# EAGLE design B167X (EAGLE 6.6.0)
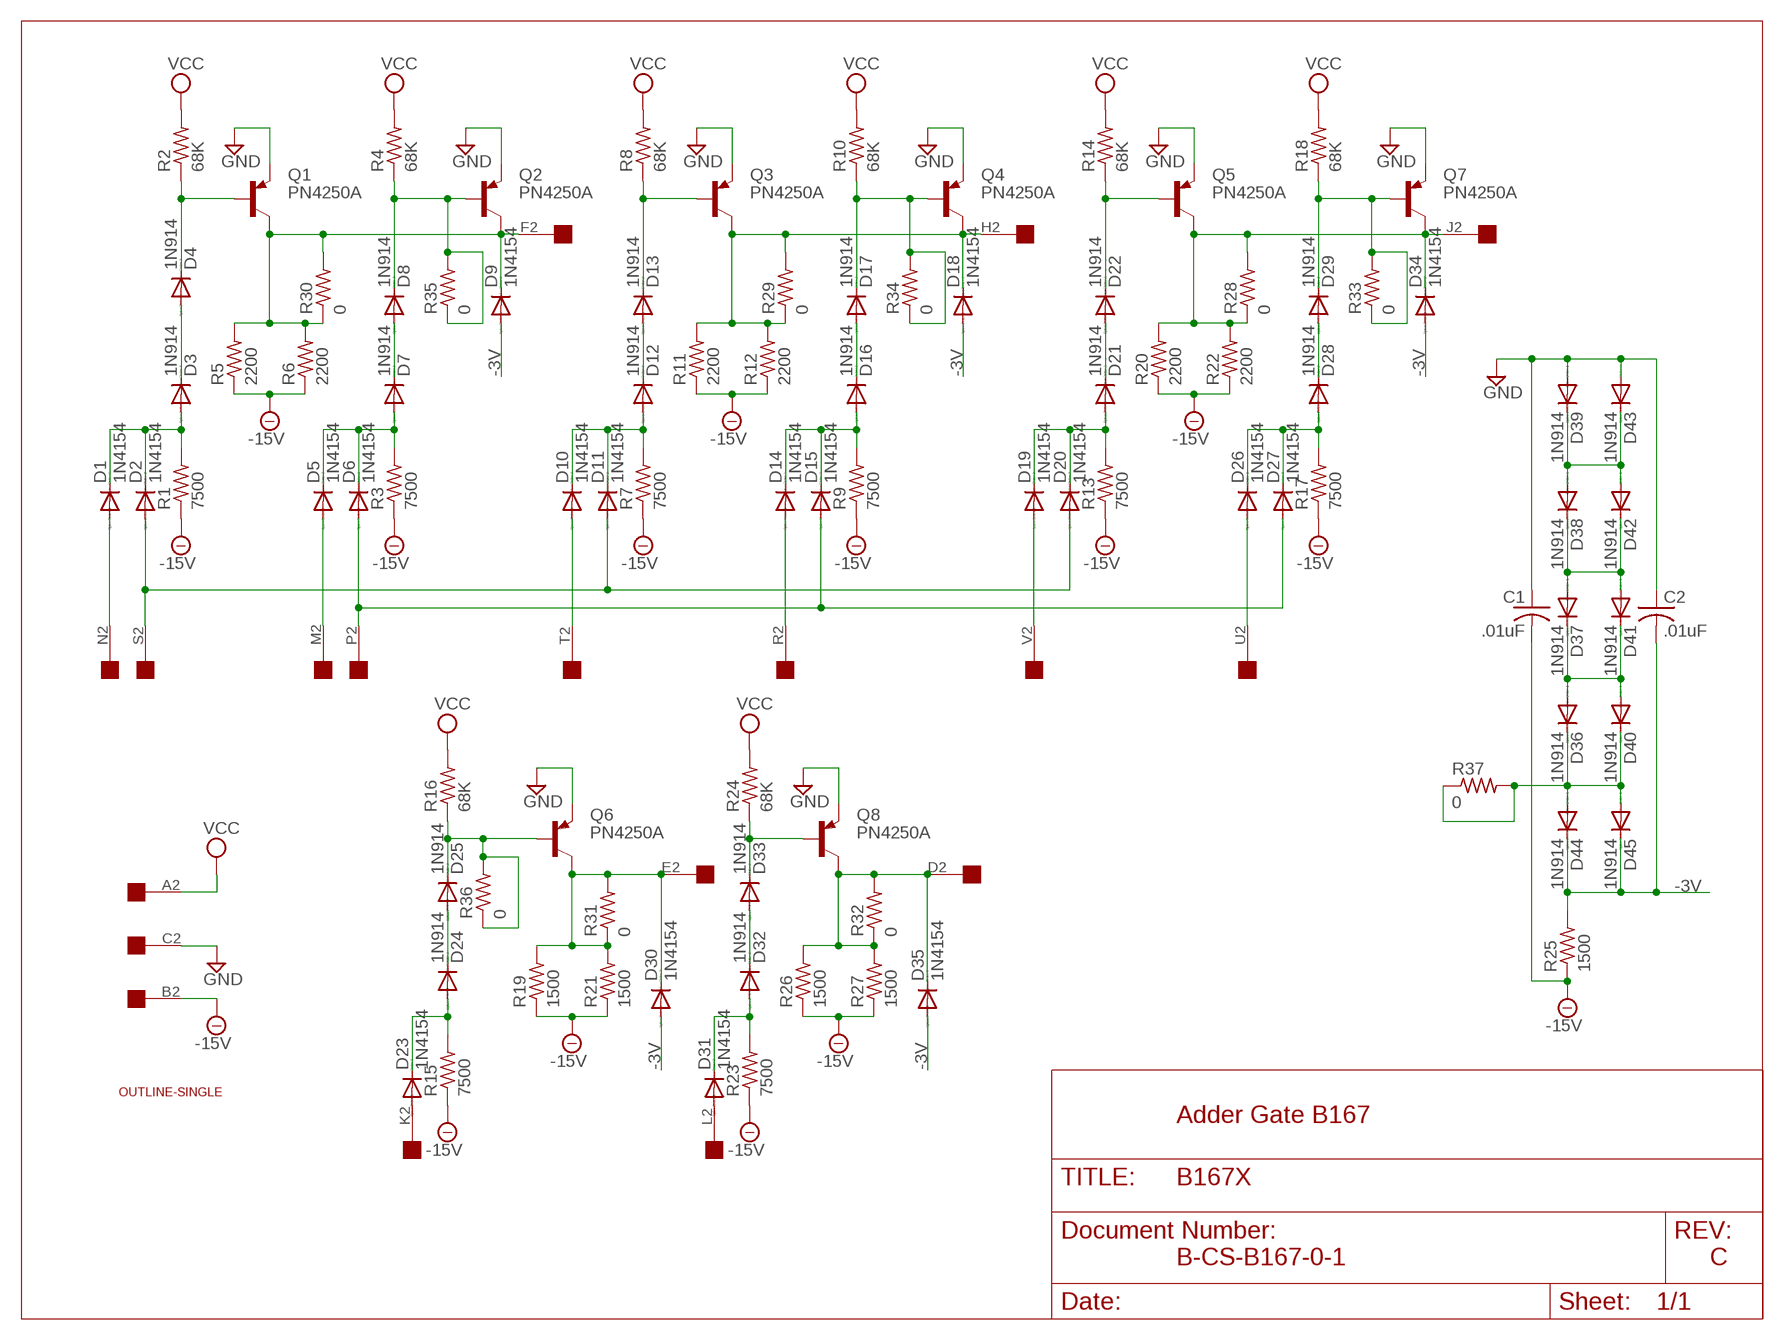
[diagram p0: schematic, sheet 1]

## Parts
C1  .01uF  C-US  [C063-025X075]
C2  .01uF  C-US  [C063-025X075]
D1  1N4154  DIODE-DO35-10  [DO35-10]
D2  1N4154  DIODE-DO35-10  [DO35-10]
D3  1N914  DIODE-DO35-10  [DO35-10]
D4  1N914  DIODE-DO35-10  [DO35-10]
D5  1N4154  DIODE-DO35-10  [DO35-10]
D6  1N4154  DIODE-DO35-10  [DO35-10]
D7  1N914  DIODE-DO35-10  [DO35-10]
D8  1N914  DIODE-DO35-10  [DO35-10]
D9  1N4154  DIODE-DO35-10  [DO35-10]
D10  1N4154  DIODE-DO35-10  [DO35-10]
D11  1N4154  DIODE-DO35-10  [DO35-10]
D12  1N914  DIODE-DO35-10  [DO35-10]
D13  1N914  DIODE-DO35-10  [DO35-10]
D14  1N4154  DIODE-DO35-10  [DO35-10]
D15  1N4154  DIODE-DO35-10  [DO35-10]
D16  1N914  DIODE-DO35-10  [DO35-10]
D17  1N914  DIODE-DO35-10  [DO35-10]
D18  1N4154  DIODE-DO35-10  [DO35-10]
D19  1N4154  DIODE-DO35-10  [DO35-10]
D20  1N4154  DIODE-DO35-10  [DO35-10]
D21  1N914  DIODE-DO35-10  [DO35-10]
D22  1N914  DIODE-DO35-10  [DO35-10]
D23  1N4154  DIODE-DO35-10  [DO35-10]
D24  1N914  DIODE-DO35-10  [DO35-10]
D25  1N914  DIODE-DO35-10  [DO35-10]
D26  1N4154  DIODE-DO35-10  [DO35-10]
D27  1N4154  DIODE-DO35-10  [DO35-10]
D28  1N914  DIODE-DO35-10  [DO35-10]
D29  1N914  DIODE-DO35-10  [DO35-10]
D30  1N4154  DIODE-DO35-10  [DO35-10]
D31  1N4154  DIODE-DO35-10  [DO35-10]
D32  1N914  DIODE-DO35-10  [DO35-10]
D33  1N914  DIODE-DO35-10  [DO35-10]
D34  1N4154  DIODE-DO35-10  [DO35-10]
D35  1N4154  DIODE-DO35-10  [DO35-10]
D36  1N914  DIODE-DO35-10  [DO35-10]
D37  1N914  DIODE-DO35-10  [DO35-10]
D38  1N914  DIODE-DO35-10  [DO35-10]
D39  1N914  DIODE-DO35-10  [DO35-10]
D40  1N914  DIODE-DO35-10  [DO35-10]
D41  1N914  DIODE-DO35-10  [DO35-10]
D42  1N914  DIODE-DO35-10  [DO35-10]
D43  1N914  DIODE-DO35-10  [DO35-10]
D44  1N914  DIODE-DO35-10  [DO35-10]
D45  1N914  DIODE-DO35-10  [DO35-10]
Q1  PN4250A  -PNP-TO5  [TO5]
Q2  PN4250A  -PNP-TO5  [TO5]
Q3  PN4250A  -PNP-TO5  [TO5]
Q4  PN4250A  -PNP-TO5  [TO5]
Q5  PN4250A  -PNP-TO5  [TO5]
Q6  PN4250A  -PNP-TO5  [TO5]
Q7  PN4250A  -PNP-TO5  [TO5]
Q8  PN4250A  -PNP-TO5  [TO5]
R1  7500  R-US_0207/10  [0207/10]
R2  68K  R-US_0207/10  [0207/10]
R3  7500  R-US_0207/10  [0207/10]
R4  68K  R-US_0207/10  [0207/10]
R5  2200  R-US_0207/10  [0207/10]
R6  2200  R-US_0207/10  [0207/10]
R7  7500  R-US_0207/10  [0207/10]
R8  68K  R-US_0207/10  [0207/10]
R9  7500  R-US_0207/10  [0207/10]
R10  68K  R-US_0207/10  [0207/10]
R11  2200  R-US_0207/10  [0207/10]
R12  2200  R-US_0207/10  [0207/10]
R13  7500  R-US_0207/10  [0207/10]
R14  68K  R-US_0207/10  [0207/10]
R15  7500  R-US_0207/10  [0207/10]
R16  68K  R-US_0207/10  [0207/10]
R17  7500  R-US_0207/10  [0207/10]
R18  68K  R-US_0207/10  [0207/10]
R19  1500  R-US_0207/10  [0207/10]
R20  2200  R-US_0207/10  [0207/10]
R21  1500  R-US_0207/10  [0207/10]
R22  2200  R-US_0207/10  [0207/10]
R23  7500  R-US_0207/10  [0207/10]
R24  68K  R-US_0207/10  [0207/10]
R25  1500  R-US_0207/10  [0207/10]
R26  1500  R-US_0207/10  [0207/10]
R27  1500  R-US_0207/10  [0207/10]
R28  0  R-US_0207/10  [0207/10]
R29  0  R-US_0207/10  [0207/10]
R30  0  R-US_0207/10  [0207/10]
R31  0  R-US_0207/10  [0207/10]
R32  0  R-US_0207/10  [0207/10]
R33  0  R-US_0207/10  [0207/10]
R34  0  R-US_0207/10  [0207/10]
R35  0  R-US_0207/10  [0207/10]
R36  0  R-US_0207/10  [0207/10]
R37  0  R-US_0207/10  [0207/10]
U$1  OUTLINE-SINGLE  [SINGLE]
U$2  EDGE-1  [EDGE-CON1]

## Nets
-3V: C2.2 D9.A D18.A D30.A D34.A D35.A D44.C D45.C R25.2
-15V: C1.2 R1.1 R3.1 R5.1 R6.1 R7.1 R9.1 R11.1 R12.1 R13.1 R15.1 R17.1 R19.1 R20.1 R21.1 R22.1 R23.1 R25.1 R26.1 R27.1 U$2.B2
GND: C1.1 C2.1 D39.A D43.A Q1.1(E) Q2.1(E) Q3.1(E) Q4.1(E) Q5.1(E) Q6.1(E) Q7.1(E) Q8.1(E) U$2.C2
N$1: D4.C Q1.2(B) R2.1
N$2: D3.C D4.A
N$3: D1.C D2.C D3.A R1.2
N$4: D8.C Q2.2(B) R4.1 R35.1 R35.2
N$5: D7.C D8.A
N$6: D5.C D6.C D7.A R3.2
N$7: D9.C Q1.3(C) Q2.3(C) R5.2 R6.2 R30.1 R30.2 U$2.F2
N$8: D13.C Q3.2(B) R8.1
N$9: D12.C D13.A
N$10: D10.C D11.C D12.A R7.2
N$11: D17.C Q4.2(B) R10.1 R34.1 R34.2
N$12: D16.C D17.A
N$13: D14.C D15.C D16.A R9.2
N$14: D18.C Q3.3(C) Q4.3(C) R11.2 R12.2 R29.1 R29.2 U$2.H2
N$15: D22.C Q5.2(B) R14.1
N$16: D21.C D22.A
N$17: D19.C D20.C D21.A R13.2
N$18: D29.C Q7.2(B) R18.1 R33.1 R33.2
N$19: D28.C D29.A
N$20: D26.C D27.C D28.A R17.2
N$21: D34.C Q5.3(C) Q7.3(C) R20.2 R22.2 R28.1 R28.2 U$2.J2
N$22: D25.C Q6.2(B) R16.1 R36.1 R36.2
N$23: D24.C D25.A
N$24: D23.C D24.A R15.2
N$25: D30.C Q6.3(C) R19.2 R21.2 R31.1 R31.2 U$2.E2
N$26: D33.C Q8.2(B) R24.1
N$27: D32.C D33.A
N$28: D31.C D32.A R23.2
N$29: D35.C Q8.3(C) R26.2 R27.2 R32.1 R32.2 U$2.D2
N$30: D38.A D39.C D42.A D43.C
N$31: D23.A U$2.K2
N$32: D37.A D38.C D41.A D42.C
N$33: D31.A U$2.L2
N$34: D36.A D37.C D40.A D41.C
N$35: D1.A U$2.N2
N$36: D2.A D11.A D20.A U$2.S2
N$37: D36.C D40.C D44.A D45.A R37.1 R37.2
N$38: D5.A U$2.M2
N$39: D6.A D15.A D27.A U$2.P2
N$40: D10.A U$2.T2
N$41: D14.A U$2.R2
N$42: D19.A U$2.V2
N$43: D26.A U$2.U2
VCC: R2.2 R4.2 R8.2 R10.2 R14.2 R16.2 R18.2 R24.2 U$2.A2

## Notes on the sheet
- Adder Gate B167
- B-CS-B167-0-1 | C

## Library data of the parts
C1 C2 = dec-con:C-US: Capacitors with funky DEC lead spacing.
D1-D45 = diode:DIODE-: DIODE
Q1-Q8 = transistor:*-PNP-: PNP Transistror
R1-R37 = rcl:R-US_: RESISTOR, American symbol
U$1 = dec-con:OUTLINE-*: Board outlines for DEC boards.
U$2 = dec-con:EDGE-1: Single-Sided DEC Edge Connector -- (side 2)

## Board
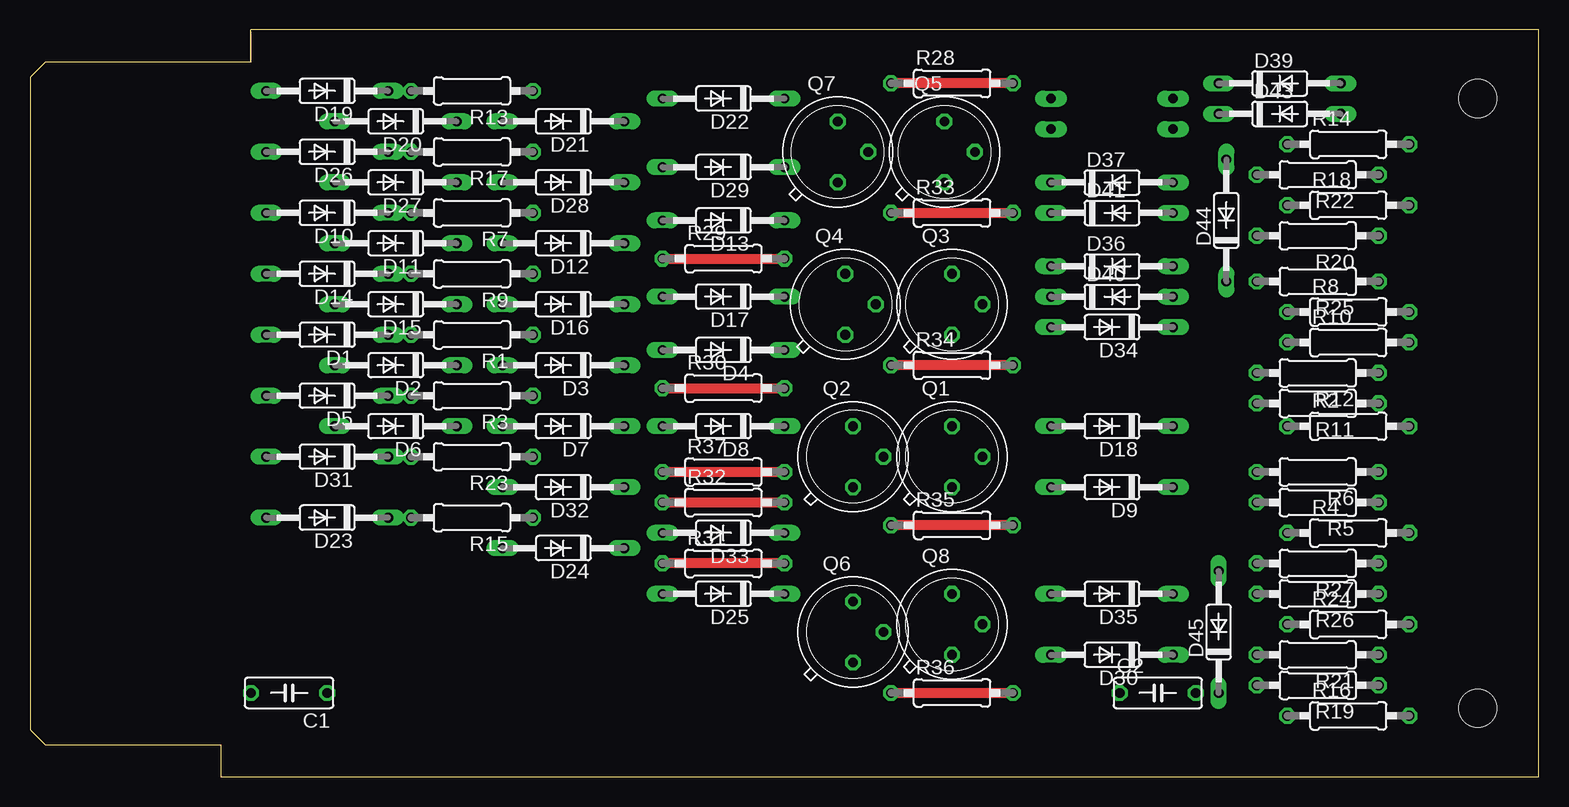
[diagram p1: board, top side]
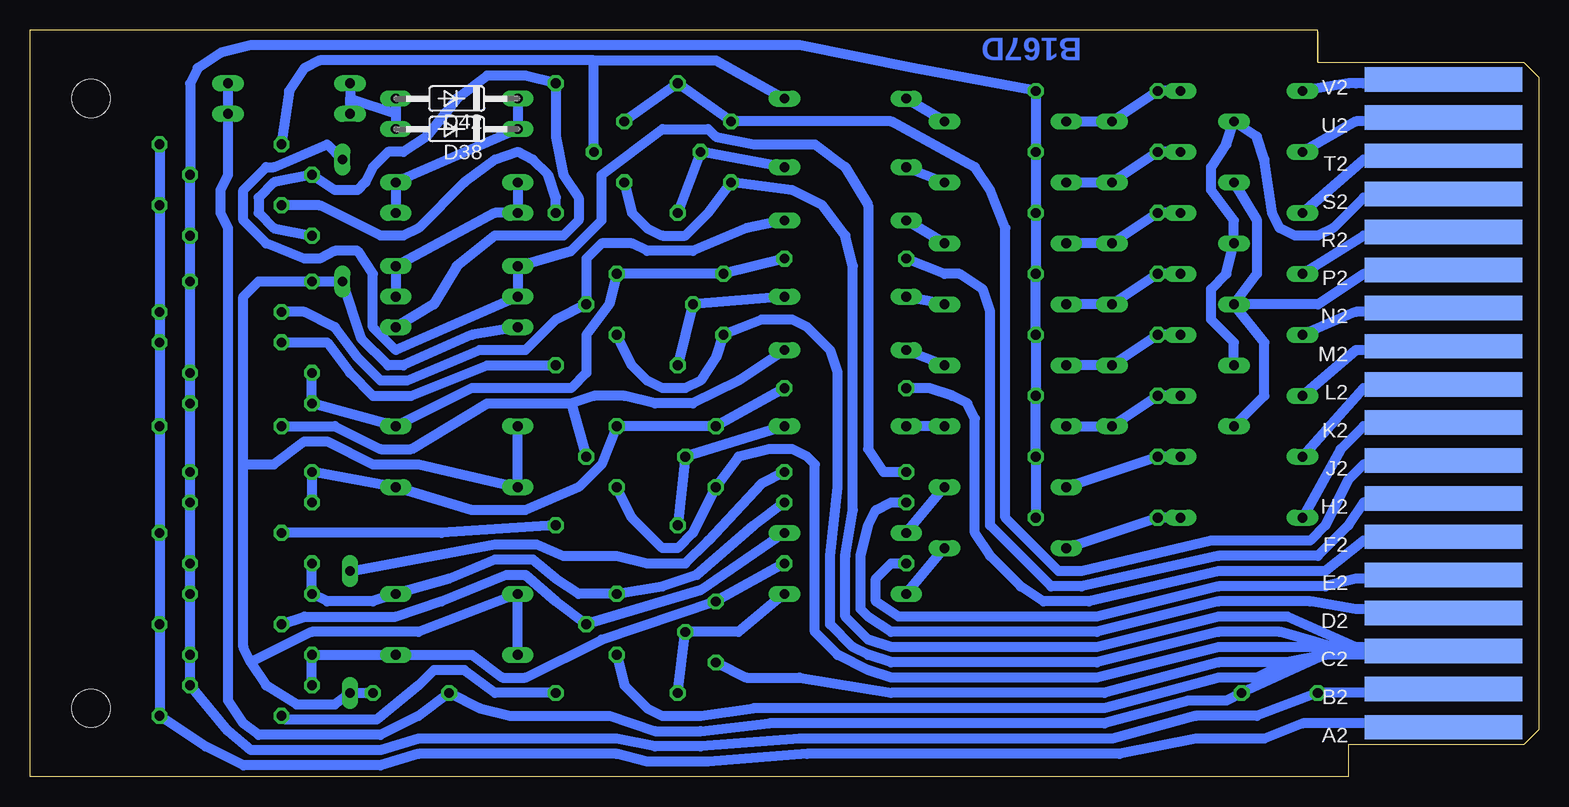
[diagram p2: board, bottom side, seen from below]

Size 125.73 x 62.23 mm. Coordinates in mm from the lower left corner, seen from the top.
Copper layers (1+16): Top 0.035mm / dielectric 1.5mm / Bottom 0.035mm
Design rules "16mils": minimum track width 16mil, minimum drill 32mil, track to track 15mil, track to pad 10mil, pad to pad 10mil, via to via 10mil, smd to smd 10mil, copper to edge 13mil, drill to drill 10mil, minimum pad ring 10mil, minimum via ring 8mil, stop-mask expansion 0mil, vias tented up to drill 0mil, thermal gap 10mil

### Footprints (pad centres in the part's own frame; a part is rotated, then mirrored left to right if it is on the bottom)
C063-025X075 = drill 0.813 octagon: 1 -2.54,0; 2 3.81,0
DO35-10 = drill 0.813 long: A 5.08,0; C -5.08,0
TO5 = drill 0.813 octagon: 1 0,-2.54; 2 2.54,0; 3 0,2.54
0207/10 = drill 0.813 octagon: 1 -5.08,0; 2 5.08,0
SINGLE = hole 3.175: 120.65,56.515; 120.65,5.715
EDGE-CON1 = smd 13.106 x 2.032 bottom: A2 7.938,4.128; B2 7.938,7.303; C2 7.938,10.477; D2 7.938,13.652; E2 7.938,16.828; F2 7.938,20.003; H2 7.938,23.177; J2 7.938,26.352; K2 7.938,29.527; L2 7.938,32.703; M2 7.938,35.877; N2 7.938,39.053; P2 7.938,42.227; R2 7.938,45.403; S2 7.938,48.578; T2 7.938,51.752; U2 7.938,54.928; V2 7.938,58.102

### Placement (x,y rotation side)
C1  22.23,6.99 180 top
C2  93.35,6.99 0 top
D1  24.77,36.83 180 top
D2  30.48,34.29 180 top
D3  44.45,34.29 180 top
D4  57.79,35.56 180 top
D5  24.77,31.75 180 top
D6  30.48,29.21 180 top
D7  44.45,29.21 180 top
D8  57.79,29.21 180 top
D9  90.17,24.13 180 top
D10  24.77,46.99 180 top
D11  30.48,44.45 180 top
D12  44.45,44.45 180 top
D13  57.79,46.35 180 top
D14  24.77,41.91 180 top
D15  30.48,39.37 180 top
D16  44.45,39.37 180 top
D17  57.79,40.01 180 top
D18  90.17,29.21 180 top
D19  24.77,57.15 180 top
D20  30.48,54.61 180 top
D21  44.45,54.61 180 top
D22  57.79,56.52 180 top
D23  24.77,21.59 180 top
D24  44.45,19.05 180 top
D25  57.79,15.24 180 top
D26  24.77,52.07 180 top
D27  30.48,49.53 180 top
D28  44.45,49.53 180 top
D29  57.79,50.8 180 top
D30  90.17,10.16 180 top
D31  24.77,26.67 180 top
D32  44.45,24.13 180 top
D33  57.79,20.32 180 top
D34  90.17,37.47 180 top
D35  90.17,15.24 180 top
D36  90.17,42.55 0 top
D37  90.17,49.53 0 top
D38  90.17,53.98 180 bottom
D39  104.14,57.78 0 top
D40  90.17,40.01 0 top
D41  90.17,46.99 0 top
D42  90.17,56.52 180 bottom
D43  104.14,55.24 0 top
D44  99.7,46.35 90 top
D45  99.06,12.06 90 top
Q1  76.84,26.67 0 top
Q2  68.58,26.67 0 top
Q3  76.84,39.37 0 top
Q4  67.95,39.37 0 top
Q5  76.2,52.07 0 top
Q6  68.58,12.06 0 top
Q7  67.31,52.07 0 top
Q8  76.84,12.7 0 top
R1  36.83,36.83 180 top
R2  109.86,29.21 0 top
R3  36.83,31.75 180 top
R4  109.86,20.32 0 top
R5  107.32,22.86 180 top
R6  107.32,25.4 180 top
R7  36.83,46.99 180 top
R8  109.86,38.73 0 top
R9  36.83,41.91 180 top
R10  109.86,36.2 0 top
R11  107.32,31.11 180 top
R12  107.32,33.66 180 top
R13  36.83,57.15 180 top
R14  109.86,52.7 0 top
R15  36.83,21.59 180 top
R16  109.86,5.08 0 top
R17  36.83,52.07 180 top
R18  109.86,47.62 0 top
R19  107.32,7.62 180 top
R20  107.32,45.09 180 top
R21  107.32,10.16 180 top
R22  107.32,50.16 180 top
R23  36.83,26.67 180 top
R24  109.86,12.7 0 top
R25  107.32,41.27 180 top
R26  107.32,15.24 180 top
R27  107.32,17.78 180 top
R28  76.84,57.78 0 top
R29  57.79,43.18 0 top
R30  57.79,32.38 0 top
R31  57.79,17.78 0 top
R32  57.79,22.86 0 top
R33  76.84,46.99 0 top
R34  76.84,34.29 0 top
R35  76.84,20.95 0 top
R36  76.84,6.99 0 top
R37  57.79,25.4 0 top
U$1  0,0 0 top
U$2  0,0 0 top

### Tracks (layer width: path | path; a pad name or v marks a point on that pad's centre or on a via)
-3V
  Bottom 0.813: D30.A D35.A 93.35,12.06 102.24,12.06 107.32,9.53 | 107.32,9.53 106.05,7.62 103.51,6.03 100.33,6.03 D45.C C2.2 | 107.32,9.53 107.95,10.79 107.95,26.04 | 107.95,26.04 107.95,40.01 106.68,41.27 R25.2 D44.C 98.11,36.51 95.89,34.29 94.62,34.29 88.9,36.83 D34.A | 107.95,26.04 105.41,26.04 102.87,27.94 100.97,27.94 97.16,26.04 93.35,26.04 D9.A D18.A
-15V
  Bottom 0.813: R15.1 R23.1 R3.1 R1.1 R9.1 R7.1 R17.1 R13.1 52.07,59.05 61.6,60.96 107.32,60.96 109.86,60.33 111.76,59.05 112.4,57.78 R22.1 R20.1 R25.1 R12.1 R11.1 R6.1 R5.1 R27.1 R26.1 R21.1 R19.1 109.22,3.81 107.32,2.22 96.52,2.22 93.35,3.17 76.84,3.17 73.66,2.54 69.85,2.54 61.6,3.17 35.56,3.17 28.58,5.08 23.5,5.08 C1.2 8.89,6.99 U$2.B2
GND
  Bottom 0.813: U$2.C2 8.26,10.79 13.97,10.79 | 13.97,10.79 15.24,10.79 | 15.24,10.79 20.96,13.34 26.67,13.34 36.83,10.79 53.98,10.79 55.88,11.43 57.79,13.34 57.79,18.41 57.15,22.23 57.15,42.55 57.79,45.09 59.69,47.62 62.23,48.9 Q7.1 69.22,46.99 71.12,45.09 73.03,45.09 74.3,45.72 75.57,46.99 Q5.1 | 15.24,10.79 17.15,10.79 | 17.15,10.79 21.59,12.06 26.67,12.06 36.83,9.53 53.98,9.53 55.88,10.16 57.15,10.79 59.06,12.7 59.06,18.41 58.42,24.13 58.42,33.66 59.06,35.56 60.96,37.47 62.23,38.1 64.77,38.1 Q4.1 68.58,34.92 69.85,33.02 71.12,32.38 73.03,32.38 74.3,33.02 75.57,34.29 Q3.1 | 17.15,10.79 26.67,10.79 36.83,8.26 53.98,8.26 55.88,8.89 58.42,10.16 60.33,12.06 60.33,26.04 60.96,26.67 62.23,27.3 64.14,27.3 66.68,26.67 Q2.1 70.49,20.32 71.76,19.05 73.03,19.05 75.57,21.59 Q1.1 | 13.97,10.79 13.97,10.16 17.78,10.16 | 17.78,10.16 C1.1 26.04,6.35 29.21,6.35 36.2,4.45 64.14,4.45 69.85,3.81 73.66,3.81 77.47,5.08 85.73,5.08 88.27,5.71 C2.1 93.35,5.08 96.52,3.49 106.68,3.49 107.95,4.45 109.22,6.35 109.22,45.72 109.86,46.99 109.86,48.9 109.22,50.16 D43.A D39.A | 17.78,10.16 20.96,9.53 | 20.96,9.53 26.67,9.53 36.2,6.99 53.98,6.99 61.6,8.26 66.04,8.26 Q6.1 | 20.96,9.53 23.5,8.26 26.67,8.26 36.2,5.71 65.41,5.71 69.85,5.08 73.03,5.08 74.3,5.71 76.2,7.62 Q8.1
N$1
  Bottom 0.813: R2.1 100.33,29.21 96.52,27.3 93.98,27.3 87.63,31.11 80.65,31.11 | 80.65,31.11 Q1.2 | D4.C 66.68,33.02 70.49,31.11 73.66,31.11 76.2,31.75 78.74,31.75 80.65,31.11
N$2
  Bottom 0.813: D3.C D4.A
N$3
  Bottom 0.813: D1.C R1.2 D2.C D3.A
N$4
  Top 0.813: R35.2 R35.1
  Bottom 0.813: D8.C Q2.2 R35.1 | R35.2 91.44,20.32 R4.1
N$5
  Bottom 0.813: D7.C D8.A
N$6
  Bottom 0.813: D7.A D6.C R3.2 D5.C
N$7
  Top 0.813: R30.1 R30.2
  Bottom 0.813: U$2.F2 8.89,19.68 14.61,19.68 17.78,17.14 26.67,17.14 37.47,14.61 41.28,14.61 43.18,15.88 45.72,18.41 46.99,20.32 46.99,29.84 47.63,31.11 48.9,31.75 50.8,32.38 R30.1 | R30.2 Q2.3 Q1.3 78.11,26.04 80.01,24.13 84.46,22.23 88.9,22.23 D9.C R6.2 R5.2
N$8
  Bottom 0.813: D13.C 66.04,45.72 70.49,43.81 74.3,43.81 75.57,44.45 78.11,44.45 79.38,43.18 Q3.2 81.92,38.1 84.46,35.56 88.27,35.56 94.3,33.02 96.52,33.02 98.43,34.92 100.33,37.47 102.87,38.73 R8.1
N$9
  Bottom 0.813: D12.C D13.A
N$10
  Bottom 0.813: D10.C R7.2 D11.C D12.A
N$11
  Top 0.813: R34.2 R34.1
  Bottom 0.813: R34.1 Q4.2 D17.C | R10.1 100.97,36.2 99.06,33.66 97.16,31.75 93.98,31.75 87.63,34.29 R34.2
N$12
  Bottom 0.813: D16.C D17.A
N$13
  Bottom 0.813: D14.C R9.2 D15.C D16.A
N$14
  Top 0.813: R29.1 R29.2
  Bottom 0.813: U$2.H2 8.26,22.86 14.61,22.86 15.88,20.95 18.42,18.41 26.67,18.41 38.1,15.88 40.64,15.88 45.72,20.95 45.72,38.73 46.36,40.64 48.26,41.91 49.53,41.91 R29.1 | R29.2 Q4.3 Q3.3 77.47,39.37 79.38,36.83 79.38,33.66 80.65,32.38 88.9,32.38 D18.C R11.2 R12.2
N$15
  Bottom 0.813: Q5.2 78.74,59.69 | 78.74,59.69 68.58,59.69 D22.C | 78.74,59.69 101.6,59.69 102.87,59.05 104.14,57.15 R14.1
N$16
  Bottom 0.813: D21.C D22.A
N$17
  Bottom 0.813: D19.C R13.2 D20.C D21.A
N$18
  Top 0.813: R33.1 R33.2
  Bottom 0.813: D29.C Q7.2 R33.1 | R33.2 81.92,48.26 82.55,50.16 83.82,51.44 85.09,52.07 87,51.44 89.54,49.53 93.35,45.72 94.62,45.09 96.52,45.09 101.6,47.62 R18.1
N$19
  Bottom 0.813: D29.A D28.C
N$20
  Bottom 0.813: D28.A D27.C R17.2 D26.C
N$21
  Top 0.813: R28.2 R28.1
  Bottom 0.813: Q5.3 R28.1 Q7.3 53.98,54.61 46.99,50.8 45.72,48.9 44.45,45.72 44.45,21.59 40.01,17.14 38.1,17.14 27.31,19.68 19.05,19.68 17.78,20.95 15.88,24.77 14.61,26.04 8.26,26.04 U$2.J2 | R20.2 105.41,45.72 106.68,46.99 106.68,48.26 105.41,49.53 R22.2 100.33,48.9 98.43,48.9 97.79,49.53 97.16,50.8 95.89,52.07 94.62,52.07 92.71,53.34 90.17,56.52 87.63,58.42 84.46,58.42 R28.2 81.92,53.34 81.28,50.16 80.01,48.26 80.01,46.35 81.28,45.09 87,45.09 90.17,42.55 92.08,39.37 D34.C
N$22
  Top 0.813: R36.1 R36.2
  Bottom 0.813: D25.C 66.68,12.06 Q6.2 R36.1 | R36.2 87,6.99 89.54,8.89 92.08,8.89 93.35,7.62 96.84,4.76 104.46,4.76 R16.1
N$23
  Bottom 0.813: D25.A D24.C
N$24
  Bottom 0.813: D23.C R15.2 D24.A
N$25
  Top 0.813: R31.2 R31.1
  Bottom 0.813: U$2.E2 8.26,16.51 15.24,16.51 17.78,15.88 26.67,15.88 36.83,13.34 53.34,13.34 55.25,14.61 55.25,16.51 53.98,17.78 R31.1 | R31.2 Q6.3 78.11,11.43 84.46,8.26 86.36,8.26 88.9,10.16 D30.C R21.2 R19.2
N$26
  Bottom 0.813: D33.C 69.85,15.56 Q8.2 81.92,14.61 84.46,16.83 86.04,16.83 91.44,14.61 95.25,13.34 102.87,13.34 R24.1
N$27
  Bottom 0.813: D33.A D32.C
N$28
  Bottom 0.813: D31.C R23.2 D32.A
N$29
  Top 0.813: R32.1 R32.2
  Bottom 0.813: U$2.D2 8.26,13.97 15.24,13.97 19.05,14.61 26.67,14.61 36.83,12.06 53.98,12.06 55.88,13.34 56.52,13.97 56.52,18.41 55.88,20.95 55.25,22.23 53.98,22.86 R32.1 | R32.2 65.41,20.95 70.17,16.83 73.03,15.88 Q8.3 80.01,15.24 81.92,16.51 83.82,18.1 87,18.1 90.81,16.51 D35.C 97.16,14.61 100.97,14.61 R26.2 R27.2
N$30
  Bottom 0.813: D42.A 95.25,55.24 | 95.25,55.24 D38.A | D39.C 99.06,56.52 | D43.C 99.06,56.52 | 99.06,56.52 95.25,55.24
N$31
  Bottom 0.813: U$2.K2 8.89,29.21 14.61,29.21 16.51,27.3 D23.A
N$32
  Bottom 0.813: D42.C D38.C D37.A D41.A
N$33
  Bottom 0.813: U$2.L2 8.89,32.38 14.61,32.38 D31.A
N$34
  Bottom 0.813: D37.C D41.C 87,46.99 D36.A D40.A
N$35
  Bottom 0.813: U$2.N2 8.89,38.73 15.24,38.73 D1.A
N$36
  Bottom 0.813: U$2.S2 8.26,48.26 14.61,48.26 17.15,45.72 18.42,45.09 20.32,45.09 21.59,45.72 22.23,46.99 22.86,51.44 23.5,53.34 D20.A 26.04,52.7 27.31,50.8 27.31,48.9 25.4,46.35 D11.A 26.04,41.91 27.31,40.64 27.31,38.1 25.4,36.2 D2.A
N$37
  Top 0.813: R37.1 R37.2
  Bottom 0.813: D44.A 100.97,52.7 105.41,50.8 106.05,50.8 107.95,48.9 107.95,46.35 106.05,44.45 102.87,43.18 101.6,43.18 100.33,43.81 98.43,43.81 97.16,41.91 97.16,37.47 95.25,35.56 D40.C D36.C 80.65,43.81 78.11,46.35 78.11,50.16 73.03,53.98 69.22,53.98 68.58,53.34 65.41,52.7 60.33,52.7 57.79,50.8 55.88,47.62 55.88,27.3 54.61,25.4 R37.1 | D45.A 87,19.37 83.5,19.37 81.28,18.41 76.84,18.41 74.3,17.78 71.12,17.78 69.22,19.68 64.77,24.45 R37.2
N$38
  Bottom 0.813: U$2.M2 8.89,35.56 15.24,35.56 D5.A
N$39
  Bottom 0.813: U$2.P2 8.89,41.91 14.61,41.91 18.42,39.37 D15.A | D6.A 22.86,31.75 22.86,36.2 D15.A | D27.A 23.5,46.35 23.5,41.91 D15.A
N$40
  Bottom 0.813: U$2.T2 9.53,51.44 14.61,51.44 D10.A
N$41
  Bottom 0.813: U$2.R2 8.89,45.09 14.61,45.09 D14.A
N$42
  Bottom 0.813: U$2.V2 8.89,57.78 14.61,57.78 15.24,57.78 15.88,57.78 D19.A
N$43
  Bottom 0.813: U$2.U2 8.89,54.61 15.24,54.61 D26.A
VCC
  Bottom 0.813: U$2.A2 9.53,4.45 19.69,4.45 22.86,3.17 28.58,3.17 34.93,1.91 60.96,1.91 69.22,1.27 74.3,1.27 76.84,1.91 93.35,1.91 96.52,0.95 107.95,0.95 111.13,2.54 R16.2 R24.2 R4.2 R2.2 R10.2 R8.2 R18.2 R14.2

### Text on the board
Bottom: B167D
200bmp: C:/Users/Vince/Documents/eagle/projects/DEC/Bxxx/B167/B167Dbackfb.bmp